# Altium schematic sheet PowerSupply.SchDoc
size A4
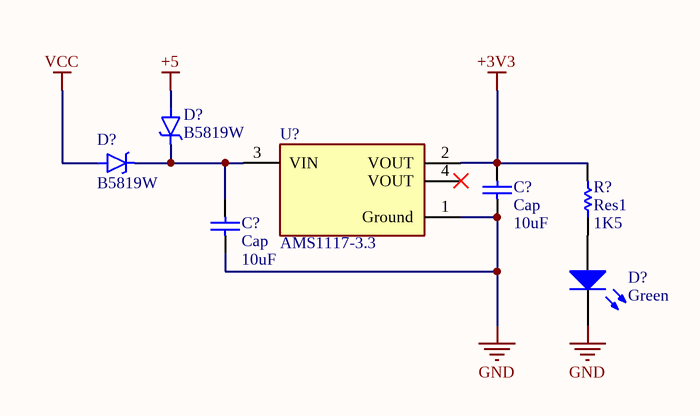
[diagram p0: PowerSupply.SchDoc]

## Parts
(Parts that share a designator on the sheet are numbered #1, #2 ... from top to bottom, then left to right.)
C?#1  Cap  value 10uF  [RAD-0.3]
C?#2  Cap  value 10uF  [RAD-0.3]
D?#1  B5819W  [SOD-123]
D?#2  B5819W  [SOD-123]
D?#3  Green  [3.2X1.6X1.1]
R?  Res1  value 1K5  [AXIAL-0.3]
U?  AMS1117-3.3  [FP-AMS1117-IPC_C]

## Nets
+3V3: C?#1.2 R?.2 U?.2(VOUT)
+5: D?#1.A
GND: C?#1.1 C?#2.1 D?#3.2(K) U?.1(Ground)
VCC: D?#2.A
NetC?#2_2: C?#2.2 D?#1.C D?#2.C U?.3(VIN)
NetD?#3_1: D?#3.1(A) R?.1

Not connected (* = marked no-connect by the designer): U? 4(VOUT)*

## Library data of the parts
C?#1 C?#2 = Cap: Capacitor; Published: 8-Jun-2000; LatestRevisionDate: 17-Jul-2002; LatestRevisionNote: Re-released for DXP Platform.; PackageReference: RAD-0.3; Publisher: Altium Limited; PackageDescription: Radial Cap, Thru-Hole; 2 Leads; 0.3 in Pin Spacing
D?#1 D?#2 = B5819W: Schottky Diode; MF: Taiwan Semiconductor; SnapEDA_Link: https://www.snapeda.com/parts/B5819W/Taiwan%20Semiconductor/view-part/105688/?ref=snap; MP: B5819W; Availability: Unavailable; Price: None; Value: *; Package: SOD-123 Taiwan Semiconductor
D?#3 = LED2: Typical RED, GREEN, YELLOW, AMBER GaAs LED; Published: 8-Jun-2000; LatestRevisionDate: 17-Jul-2002; LatestRevisionNote: Re-released for DXP Platform.; PackageVersion: Feb-2002; PackageReference: 3.2X1.6X1.1; Publisher: Altium Limited; PackageDescription: SM LED; 2 Flat Leads
R? = Res1: Resistor; Published: 8-Jun-2000; LatestRevisionDate: 17-Jul-2002; LatestRevisionNote: Re-released for DXP Platform.; PackageReference: AXIAL-0.3; Publisher: Altium Limited; PackageDescription: Axial Device, Thru-Hole; 2 Leads; 0.3 in Pin Spacing
U? = CMP-209535-000001-1: LDO Voltage Regulators 1A, 3.3V; Manufacturer: Advanced Monolithic Systems; Dropout Voltage: 1.1V; Output Type: Fixed; Nominal Supply Current: 5mA; Max Power Dissipation: 1.2W; Max Supply Voltage: 15V; Number Of Outputs: 1; Standoff Height: 0.64mm; Max Junction Temp: +125°C; Height: 1.8mm; Package: AMS1117; Device Class L2: Power Management ICs; ComponentLink2Description: Datasheet; ComponentLink2URL: http://www.advanced-monolithic.com/pdf/ds1117.pdf; Category: IC; RoHS: TRUE; Automotive: No; Device Class L1: Integrated Circuits (ICs); Output Current: 1A; Device Class L3: Voltage Regulators - Linear; Temperature: -40°C to +125°C; Output Voltage: 3.3V; Manufacturer Part Number: AMS1117-3.3; Temperature Range Low: -40°C; Octopart: https://octopart.com/ams1117-3.3-advanced+monolithic+systems-25899300; Lead Free: Yes; Ipc Land Pattern Name: SOT229P700X180-4; Temperature Range High: +125°C